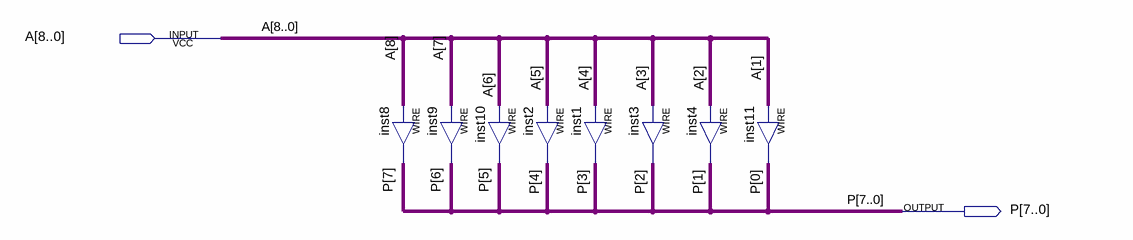
[diagram p0: schematic sheet]
// Quartus schematic withoutLastBit.bdf as structural Verilog: 8 symbols, 2 pins
module withoutLastBit (
  input  [8:0] A,
  output [7:0] P
);

  assign P[7] = A[8];  // WIRE inst8
  assign P[6] = A[7];  // WIRE inst9
  assign P[5] = A[6];  // WIRE inst10
  assign P[3] = A[4];  // WIRE inst1
  assign P[4] = A[5];  // WIRE inst2
  assign P[2] = A[3];  // WIRE inst3
  assign P[1] = A[2];  // WIRE inst4
  assign P[0] = A[1];  // WIRE inst11
endmodule
